# EAGLE board humanoid-11 (EAGLE 7.2.0)
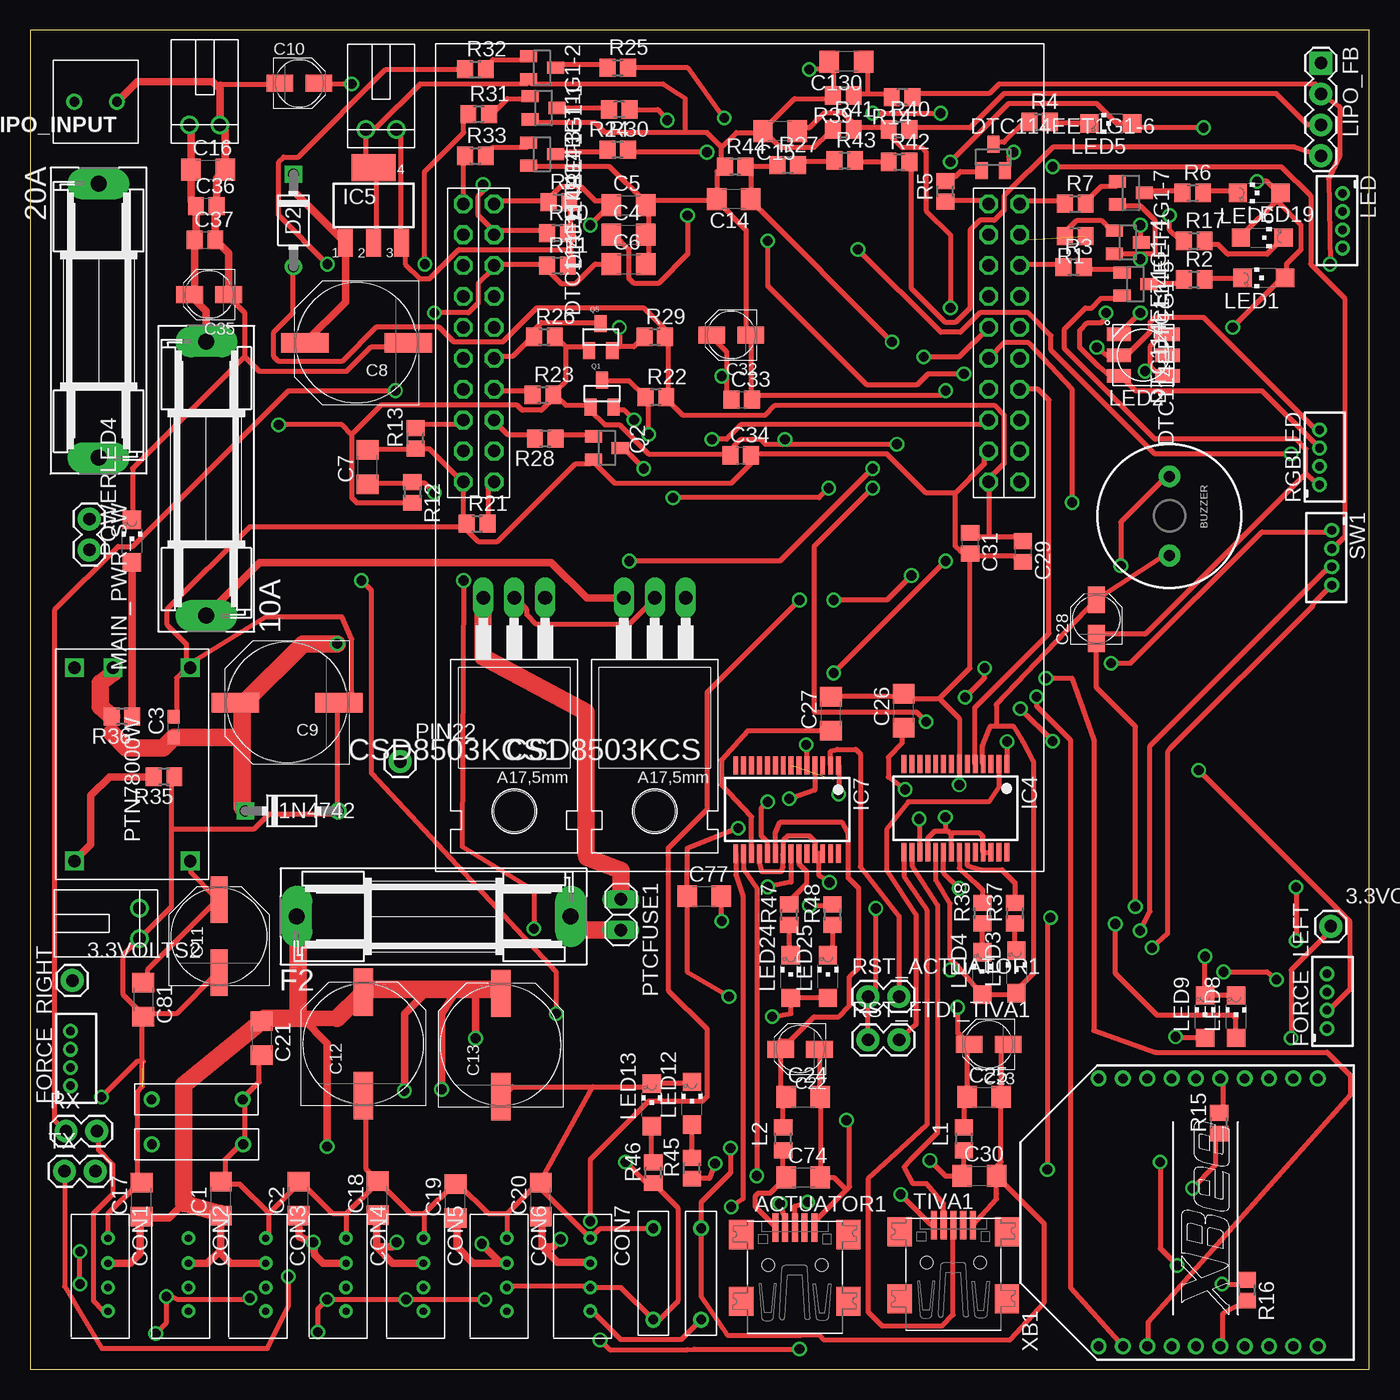
[diagram p10: board, top side]
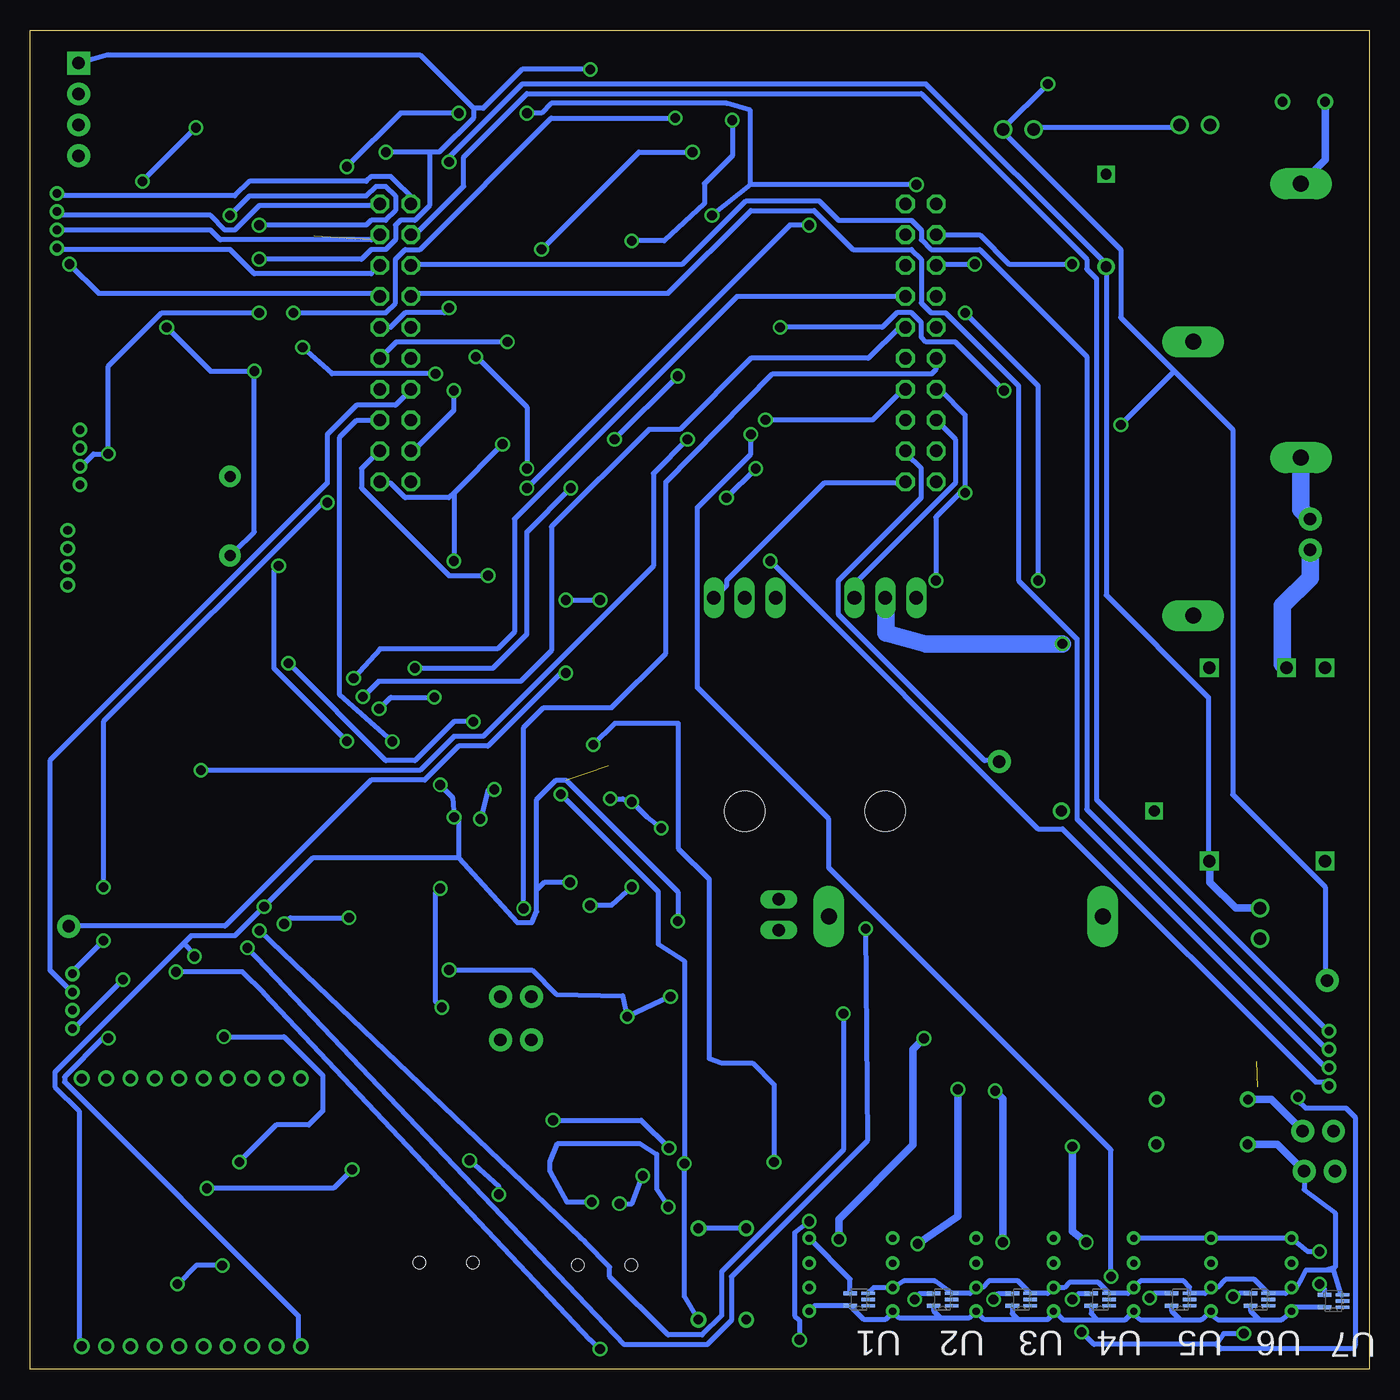
[diagram p11: board, bottom side, seen from below]

Size 110 x 110 mm. Coordinates in mm from the lower left corner, seen from the top.
Outline: 0,0 110,0 110,110 0,110 0,0
Copper layers (1*16): Top 0.035mm / dielectric 1.5mm / Bottom 0.035mm
Design rules "default *": minimum track width 0.4mm, minimum drill 0.8mm, track to track 0.4mm, track to pad 8mil, pad to pad 8mil, via to via 8mil, smd to smd 8mil, copper to edge 40mil, drill to drill 0.8mm, minimum pad ring 10mil, minimum via ring 8mil, stop-mask expansion 4mil, vias tented up to drill 0mil, thermal gap 10mil
Net classes: 0 default: width 0.35 mm

## Footprints (pad centres in the part's own frame; a part is rotated, then mirrored left to right if it is on the bottom)
DO41-3 = drill 0.9: A 3.81,0 | drill 0.9 square: C -3.81,0
2PINRIGHT = drill 1.02: P$1 0,0; P$2 2.5,0
1X01 = drill 1.016 pad 1.88: 1 0,0
SH22,5 = drill 1.321 pad 2.54 long: 1 -11.252,0; 2 11.252,0
USB-MINIB = smd 0.5 x 2.308: D+ 0,4.064; D- -0.8,4.064; GND 1.6,4.064; ID 0.8,4.064; VBUS -1.6,4.064 | smd 2 x 2.4: GND1 -4.4,-2; GND2 -4.4,3.5; GND3 4.4,3.5; GND4 4.4,-2 | hole 1: -2.2,1; 2.2,1
BUZZER-12MM = drill 0.9 pad 1.778: + 3.25,0; - -3.25,0
C1206 = smd 1.6 x 1.8: 1 -1.4,0; 2 1.4,0
C1608 = smd 1.1 x 1: 1 -0.85,0; 2 0.85,0
PANASONIC_G = smd 3.9 x 1.6: + 4.25,0; - -4.25,0
PANASONIC_B = smd 2.2 x 1.4: + 1.6,0; - -1.6,0
PANASONIC_E = smd 3.8 x 1.4: + 3,0; - -3,0
C0805 = smd 1.3 x 1.5: 1 -0.85,0; 2 0.85,0
B4B-ZR = drill 0.6: 1 7.95,-1.75; 2 6,-1.75; 3 4,-1.75; 4 1.95,-1.75
TO220 = drill 1.118 long: 1 -2.54,-6.35; 2 0,-6.35; 3 2.54,-6.35 | hole 3.302: 0,11.176
SOT23 = smd 1 x 1.4: 1 -0.95,-1.1; 2 0.95,-1.1; 3 0,1.1
B4B-ZR' = drill 0.7 pad 1.1: 1 -2.25,0; 2 -0.75,0; 3 0.75,0; 4 2.25,0
SSOP28 = smd 0.4 x 1.5: 1 -4.225,-3.625; 2 -3.575,-3.625; 3 -2.925,-3.625; 4 -2.275,-3.625; 5 -1.625,-3.625; 6 -0.975,-3.625; 7 -0.325,-3.625; 8 0.325,-3.625; 9 0.975,-3.625; 10 1.625,-3.625; 11 2.275,-3.625; 12 2.925,-3.625; 13 3.575,-3.625; 14 4.225,-3.625; 15 4.225,3.625; 16 3.575,3.625; 17 2.925,3.625; 18 2.275,3.625; 19 1.625,3.625; 20 0.975,3.625; 21 0.325,3.625; 22 -0.325,3.625; 23 -0.975,3.625; 24 -1.625,3.625; 25 -2.275,3.625; 26 -2.925,3.625; 27 -3.575,3.625; 28 -4.225,3.625
SOT223 = smd 1.219 x 2.235: 1 -2.311,-3.099; 2 0,-3.099; 3 2.311,-3.099 | smd 3.6 x 2.2: 4 0,3.099
L0805 = smd 1.3 x 1.5: 1 -0.95,0; 2 0.95,0
CHIPLED_1206 = smd 1.5 x 1.5: A 0,-1.75; C 0,1.75
RGBLED5050 = smd 2 x 1.1: 1 -2,1.7; 2 -2,0; 3 -2,-1.7; 4 2,-1.7; 5 2,0; 6 2,1.7
1X04 = drill 1.016 pad 1.88 square: 1 0,0 | drill 1.016 pad 1.88: 2 2.54,0; 3 5.08,0; 4 7.62,0
ED350V-02P = drill 0.8: P$1 0,0; P$2 3.5,0
1X02 = drill 1.016 pad 1.88: 1 0,0; 2 2.54,0
1X02' = drill 1.016 long: 1 -1.27,0; 2 1.27,0
R0805 = smd 1.3 x 1.5: 1 -0.85,0; 2 0.85,0
SOT50P160X60-5N = smd 1.118 x 0.254: 1 -0.737,0.508; 2 -0.737,0; 3 -0.737,-0.508 | smd 1.118 x 0.305: 4 0.737,-0.508; 5 0.737,0.508
TIVA = drill 1.02 octagon: P$1 0,0; P$2 2.54,0; P$3 5.08,0; P$4 7.62,0; P$5 10.16,0; P$6 12.7,0; P$7 15.24,0; P$8 17.78,0; P$9 20.32,0; P$10 22.86,0; P$11 0,2.54; P$12 2.54,2.54; P$13 5.08,2.54; P$14 7.62,2.54; P$15 10.16,2.54; P$16 12.7,2.54; P$17 15.24,2.54; P$18 17.78,2.54; P$19 20.32,2.54; P$20 22.86,2.54; P$21 0,43.18; P$22 2.54,43.18; P$23 5.08,43.18; P$24 7.62,43.18; P$25 10.16,43.18; P$26 12.7,43.18; P$27 15.24,43.18; P$28 17.78,43.18; P$29 20.32,43.18; P$30 22.86,43.18; P$31 0,45.72; P$32 2.54,45.72; P$33 5.08,45.72; P$34 7.62,45.72; P$35 10.16,45.72; P$36 12.7,45.72; P$37 15.24,45.72; P$38 17.78,45.72; P$39 20.32,45.72; P$40 22.86,45.72
PTN78000W = drill 1.02 square: P1 1.52,11.045; P2 1.52,4.705; P3 1.52,1.525; P4 17.4,1.52; P5 17.4,11.045
V18ZA2P = drill 0.8: P$1 0,0; P$2 7.5,0
XBEE = drill 0.8 pad 1.27: 1 -11,9; 2 -11,7; 3 -11,5; 4 -11,3; 5 -11,1; 6 -11,-1; 7 -11,-3; 8 -11,-5; 9 -11,-7; 10 -11,-9; 11 11,-9; 12 11,-7; 13 11,-5; 14 11,-3; 15 11,-1; 16 11,1; 17 11,3; 18 11,5; 19 11,7; 20 11,9

## Placement (x,y rotation side)
1N4742  [DO41-3]  21.47,45.87 0 top
3.3V1  2PINRIGHT  [2PINRIGHT]  27.56,101.85 0 top
3.3VOLTS1  M01PTH  [1X01]  106.86,36.39 0 top
3.3VOLTS2  M01PTH  [1X01]  3.45,31.93 0 top
5V1  2PINRIGHT  [2PINRIGHT]  8.97,35.38 90 top
10A  FUSESH22,5  [SH22,5]  14.45,73.16 90 top
20A  FUSESH22,5  [SH22,5]  5.6,86.14 270 top
ACTUATOR1  [USB-MINIB]  62.81,7.56 0 top
BUZZER  BUZZERPTH  [BUZZER-12MM]  93.6,70.1 270 top
C1  100nF  [C1206]  15.65,14 90 top
C2  100nF  [C1206]  22.03,14 90 top
C3  2.2uF  [C1608]  11.76,52.75 90 top
C4  0.1uF  [C1206]  49.15,93.22 0 top
C5  0.1uF  [C1206]  49.15,95.63 0 top
C6  0.1uF  [C1206]  49.15,90.81 0 top
C7  0.1uF  [C1206]  27.71,74.12 90 top
C8  220uF 25V  [PANASONIC_G]  26.8,84.33 180 top
C9  470uF 25V  [PANASONIC_G]  21.09,54.77 180 top
C10  22uF 10V  [PANASONIC_B]  22.1,105.66 0 top
C11  100uF 10V  [PANASONIC_E]  15.51,35.57 90 top
C12  220uF 25V  [PANASONIC_G]  27.36,26.73 90 top
C13  220uF 25V  [PANASONIC_G]  38.65,26.62 90 top
C14  100nF  [C1206]  57.78,96.14 180 top
C15  100nF  [C1206]  61.59,101.73 180 top
C16  100nF  [C1206]  14.61,98.55 0 top
C17  100nF  [C1206]  9.13,13.93 90 top
C18  100nF  [C1206]  28.54,14.06 90 top
C19  100nF  [C1206]  34.92,13.8 90 top
C20  100nF  [C1206]  41.94,13.93 90 top
C21  100nF  [C1206]  18.99,27.2 270 top
C22  4.7uF 10V  [PANASONIC_B]  63.25,26.29 180 top
C23  4.7uF 10V  [PANASONIC_B]  78.74,26.67 180 top
C24  100nF  [C1206]  63.5,22.35 0 top
C25  100nF  [C1206]  78.36,22.35 0 top
C26  100nF  [C1206]  71.75,54.1 90 top
C27  100nF  [C1206]  65.79,53.85 90 top
C28  10uF 16V  [PANASONIC_B]  87.6,61.62 90 top
C29  0.1uF  [C0805]  81.56,67.18 270 top
C30  10nF  [C1206]  77.98,15.88 0 top
C31  0.1uF  [C0805]  77.22,67.87 270 top
C32  10uF 16V  [PANASONIC_B]  57.58,84.96 180 top
C33  0.1uF  [C0805]  58.45,79.65 0 top
C34  0.1uF  [C0805]  58.37,75.08 0 top
C35  10uF 16V  [PANASONIC_B]  14.68,88.29 180 top
C36  0.1uF  [C0805]  14.45,95.55 0 top
C37  0.1uF  [C0805]  14.35,92.79 0 top
C74  10nF  [C1206]  63.5,15.75 0 top
C77  100nF  [C1206]  55.37,38.86 0 top
C81  100nF  [C1206]  9.27,30.35 270 top
C130  100nF  [C1206]  67.06,107.44 180 top
CON1  B4B-ZR  [B4B-ZR]  8.13,12.7 270 top
CON2  B4B-ZR  [B4B-ZR]  14.73,12.7 270 top
CON3  B4B-ZR  [B4B-ZR]  21.08,12.7 270 top
CON4  B4B-ZR  [B4B-ZR]  27.69,12.7 270 top
CON5  B4B-ZR  [B4B-ZR]  34.04,12.7 270 top
CON6  B4B-ZR  [B4B-ZR]  40.89,12.7 270 top
CON7  B4B-ZR  [B4B-ZR]  47.75,12.7 270 top
CSD8503KCS  BUZ20  [TO220]  51.31,57.02 180 top
CSD8503KCS1  BUZ20  [TO220]  39.75,57.02 180 top
D2  1N5817  [DO41-3]  21.61,94.39 270 top
DTC114EET1G1-1  [SOT23]  42.16,103.63 270 top
DTC114EET1G1-2  [SOT23]  42.04,106.93 270 top
DTC114EET1G1-3  [SOT23]  42.04,99.82 270 top
DTC114EET1G1-4  [SOT23]  90.17,92.58 270 top
DTC114EET1G1-5  [SOT23]  90.81,89.15 270 top
DTC114EET1G1-6  [SOT23]  79.12,99.57 0 top
DTC114EET1G1-7  [SOT23]  90.42,96.65 270 top
F2  FUSESH22,5  [SH22,5]  33.13,37.2 0 top
FITPC  2PINRIGHT  [2PINRIGHT]  13.08,102.23 0 top
FORCE_LEFT  B4B-ZR  [B4B-ZR']  106.55,30.23 90 top
FORCE_RIGHT  B4B-ZR  [B4B-ZR']  3.3,25.53 90 top
IC4  FT232RL  [SSOP28]  76.01,46.09 180 top
IC5  LM2936MP-3.3  [SOT223]  28.19,95.63 0 top
IC7  FT232RL  [SSOP28]  62.18,45.98 180 top
L1  33 mH 1.5A  [L0805]  76.71,18.92 90 top
L2  33 mH 1.5A  [L0805]  61.85,18.92 90 top
LED  B4B-ZR  [B4B-ZR']  107.82,94.36 270 top
LED1  [CHIPLED_1206]  101.35,89.66 90 top
LED2  RGBLED5050  [RGBLED5050]  91.44,83.31 180 top
LED3  [CHIPLED_1206]  81.03,32.64 0 top
LED4  [CHIPLED_1206]  78.23,32.51 0 top
LED5  [CHIPLED_1206]  88.77,102.36 90 top
LED6  [CHIPLED_1206]  100.97,96.65 90 top
LED8  [CHIPLED_1206]  99.06,28.96 0 top
LED9  [CHIPLED_1206]  96.52,28.96 0 top
LED12  [CHIPLED_1206]  54.36,21.84 0 top
LED13  [CHIPLED_1206]  51.05,21.72 0 top
LED19  [CHIPLED_1206]  101.22,92.96 270 top
LED24  [CHIPLED_1206]  62.48,32.26 0 top
LED25  [CHIPLED_1206]  65.53,32.26 0 top
LIPO_FB  [1X04]  106.05,107.31 270 top
LIPO_INPUT  ST02-3.5MM  [ED350V-02P]  7.11,104.14 180 top
MAIN_PWR_SW  [1X02]  4.84,69.85 270 top
PIN22  M01PTH  [1X01]  30.39,49.91 0 top
POWERLED4  [CHIPLED_1206]  8.34,68.04 0 top
PTCFUSE1  [1X02']  48.51,37.34 270 top
Q1  MOSFET-NCHANNELBSS138  [SOT23]  46.97,80.15 0 top
Q2  [SOT23]  47.37,75.69 270 top
Q5  MOSFET-NCHANNELBSS138  [SOT23]  46.86,84.8 0 top
R1  10K  [R0805]  85.85,93.09 180 top
R2  330E  [R0805]  95.63,89.53 0 top
R3  10K  [R0805]  85.72,90.55 0 top
R4  330E  [R0805]  82.93,102.49 0 top
R5  10K  [R0805]  75.18,96.77 90 top
R6  330E  [R0805]  95.5,96.65 0 top
R7  10K  [R0805]  85.85,95.76 0 top
R9  10K  [R0805]  43.43,95.89 0 top
R10  10K  [R0805]  43.31,93.34 0 top
R11  10K  [R0805]  43.31,90.68 0 top
R12  10K  [R0805]  31.39,72.03 270 top
R13  1M  [R0805]  31.65,76.48 90 top
R14  10k  [R0805]  71.63,104.52 180 top
R15  330R  [R0805]  97.66,20.19 90 top
R16  330R  [R0805]  99.95,6.48 270 top
R17  330E  [R0805]  95.63,92.71 0 top
R21  1M  [R0805]  36.7,69.47 0 top
R22  10K  [R0805]  51.4,79.88 0 top
R23  10K  [R0805]  42.12,80.05 0 top
R24  330E  [R0805]  48.39,103.5 180 top
R25  330E  [R0805]  48.26,106.93 0 top
R26  10K  [R0805]  42.24,84.83 0 top
R27  10k  [R0805]  62.23,98.93 0 top
R28  10k  [R0805]  42.29,76.45 180 top
R29  10K  [R0805]  51.31,84.81 0 top
R30  330E  [R0805]  48.26,100.2 0 top
R31  10K  [R0805]  36.83,103.12 0 top
R32  10K  [R0805]  36.58,106.81 0 top
R33  10K  [R0805]  36.58,99.69 0 top
R35  21K  [R0805]  10.99,48.67 180 top
R36  1k  [R0805]  7.53,53.62 180 top
R37  270E  [R0805]  80.9,37.47 90 top
R38  270E  [R0805]  78.23,37.47 90 top
R39  10k  [R0805]  66.8,104.65 180 top
R40  30k  [R0805]  71.37,101.85 0 top
R41  10k  [R0805]  66.8,101.85 0 top
R42  30k  [R0805]  71.37,99.19 0 top
R43  30k  [R0805]  66.93,99.31 0 top
R44  10k  [R0805]  57.91,98.81 0 top
R45  330E  [R0805]  54.36,16.51 90 top
R46  330E  [R0805]  51.18,16.13 90 top
R47  270E  [R0805]  62.36,37.34 90 top
R48  270E  [R0805]  65.91,37.34 90 top
RGBLED  B4B-ZR  [B4B-ZR']  105.92,74.93 90 top
RST_ACTUATOR1  [1X02]  68.83,30.61 0 top
RST_FTDI_TIVA1  [1X02]  68.83,27.05 0 top
RX  [1X02]  2.92,19.56 0 top
SW1  B4B-ZR  [B4B-ZR']  106.93,66.67 270 top
TIVA1  [USB-MINIB]  75.84,7.77 0 top
TX  [1X02]  2.79,16.26 0 top
U1  TPD2E2U06  [SOT50P160X60-5N]  41.91,5.71 180 bottom
U2  TPD2E2U06  [SOT50P160X60-5N]  35.05,5.71 180 bottom
U3  TPD2E2U06  [SOT50P160X60-5N]  28.57,5.71 180 bottom
U4  TPD2E2U06  [SOT50P160X60-5N]  22.1,5.71 180 bottom
U5  TPD2E2U06  [SOT50P160X60-5N]  15.49,5.71 180 bottom
U6  TPD2E2U06  [SOT50P160X60-5N]  9.02,5.71 180 bottom
U7  TPD2E2U06  [SOT50P160X60-5N]  2.92,5.59 180 bottom
U$1  TIVA  [TIVA]  81.28,72.9 90 top
U$4  PTN78000WTHROUGHHOLE  [PTN78000W]  2.09,59.15 270 top
V8ZA2P-1  V18ZA2P  [V18ZA2P]  17.45,22.15 180 top
V8ZA2P-2  V18ZA2P  [V18ZA2P]  17.48,18.47 180 top
V8ZA2P-3  V18ZA2P  [V18ZA2P]  55.12,4.06 90 top
V8ZA2P-4  V18ZA2P  [V18ZA2P]  51.18,4.06 90 top
XB1  XBEE  [XBEE]  96.78,12.88 90 top

## Tracks (layer width: path | path; a pad name or v marks a point on that pad's centre or on a via)
3.3V  (via drill 0.8)
  Top 0.4: 44.4,92 44.4,93.2 R10.2 44.4,93.6 44.4,95.6 R9.2 | 44.4,92 44.4,90.8 R11.2 | v26.4,105.6 24,105.6 C10.+ | 3.3V1.P$2 30.4,101.6 30.4,92.8 IC5.3 30.8,92.4 30.8,90.8 32,89.6 32.8,89.6 35.2,92 44.4,92 | v103.6,27.2 103.6,32.8 106.8,36 3.3VOLTS1.1 | 57.2,81.6 57.2,83.6 56,84.8 C32.+ | 57.2,81.6 57.2,80 C33.1 | 44,84 45.6,84 Q5.1 | 44,84 43.2,84.8 R26.2 | 43.2,80 44,79.2 46,79.2 Q1.1 46,78.8 47.2,77.6 48.4,77.6 50.8,75.2 57.2,75.2 | 26.4,76.8 26.4,71.6 26.8,71.2 31.2,71.2 R12.2 | 26.4,76.8 28.8,79.2 40,79.2 40.4,78.8 42,78.8 43.2,80 | 43.2,80 R23.2 43.2,80.4 44,81.2 44,84 | 62,76 60.4,76 60,76.4 58.4,76.4 57.2,75.2 | 62,76 v71.2,76 | 57.2,75.2 C34.1 | v56.8,81.6 57.2,81.6 | 62,76 v62,76.4 | v75.2,66.4 v66,57.2 | v20.4,77.6 25.6,77.6 26.4,76.8
  Bottom 0.4: v26.4,105.6 30,102 3.3V1.P$2 30,101.6 20.4,92 20.4,86.4 16,82 | 16,82 11.2,77.2 11.2,47.2 3.6,39.6 3.6,32 3.3VOLTS2.1 | v103.6,27.2 104,27.2 107.2,24 107.2,23.6 88,4.4 88,2 XB1.1 | v71.2,76 75.2,72 | 75.2,72 75.6,71.6 79.2,71.6 80.4,72.8 81.2,72.8 U$1.P$1 | v62,76.4 v56.8,81.6 | v66,57.2 66.4,57.2 72.4,51.2 74.8,51.2 77.6,48.4 82,48.4 94,36.4 106.8,36.4 3.3VOLTS1.1 | 75.2,72 v75.2,66.4 | v20.4,77.6 16,82
5V  (via drill 0.8)
  Top 0.4: 92,82.4 92.4,82 93.2,82 LED2.1 | 92,82.4 92,84 93.2,85.2 LED2.3 | v91.6,82 92,82.4 | 102.4,96 102.8,96.4 LED6.A | 102.4,96 99.6,93.2 LED19.A | v96.4,102 90.8,102 LED5.A 90.4,102.4 89.2,102.4 87.6,104 80.4,104 v75.6,99.2 | v100.8,97.6 101.6,97.6 102.4,96.8 LED6.A | 102.4,96 104.4,94 104.4,92 103.2,90.8 103.2,90 LED1.A 102.8,89.6 v98.8,85.6 | 102.4,96 LED6.A | v75.6,32.8 76,33.2 76.07,33.26 | C81.1 9.6,32 9.6,32.8 15.2,38.4 C11.+ 15.2,38.8 13.2,40.8 13.2,41.6 U$4.P5 | 78.8,68.4 77.6,68.4 C31.1 | 78.8,68.4 81.2,68.4 C29.1 | 78.8,68.4 78.8,72.8 U$1.P$11 78.8,73.2 80,74.4 80,78.4 79.2,79.2 61.2,79.2 60.4,78.4 53.6,78.4 52.4,79.6 R22.2 52.4,80 52.4,84.8 R29.2 52.4,85.2 50.4,87.2 41.6,87.2 38.8,84.4 34.8,84.4 33.6,85.6 28.4,85.6 25.6,82.8 20.4,82.8 20,83.2 20,85.2 21.6,86.8 21.6,90.4 D2.A
  Top 0.406: IC7.4 64.46,47.57 v62.36,46.86 | v58.17,44.45 57.4,44.2 53.98,42.8 C77.1 53.97,32.64 v57.4,30.61 | v60.96,28.96 62.51,29.21 LED24.A LED25.A | IC4.19 74.39,40.17 75.56,38.23 75.56,33.68 76.07,33.26 LED4.A 80.9,30.76 LED3.A 81.03,31.11 82.42,32.51 82.42,49.91 81.53,51.56 80.77,52.83 79.25,52.83 | IC4.4 78.23,49.77 78.23,51.18 78.87,52.83 79.25,52.83 | BUZZER.+ 93.14,66.85 C28.+ 79.38,54.61 79.38,52.96 79.25,52.83 | IC7.19 60.56,43.33 60.07,43.81 60.07,46.1 v60.58,46.61
  Bottom 0.4: BUZZER.+ 93.2,67.2 91.6,68.8 v91.6,82 95.2,82 v98.8,85.6 | v100.8,97.6 v96.4,102 | v75.6,32.8 68.8,32.8 66.8,30.8 61.33,30.67 v60.96,28.96 | U$4.P5 13.2,42 13.2,55.2 21.6,63.6 21.6,90.4 D2.A 21.6,90.8 36.4,105.6 69.6,105.6 75.6,99.6 v75.6,99.2
  Bottom 0.406: v62.36,46.86 61.34,46.86 v60.58,46.61 59.31,45.34 v58.17,44.45 | v57.4,30.61 v60.96,28.96
  Bottom 0.61: 5V1.P$2 10.96,37.88 13.08,40.01 13.08,41.7 U$4.P5
GND  (via drill 0.8)  (2 unrouted)
  Top 0.4: IC5.2 28.4,92.8 28.4,98.4 IC5.4 28,98.8 27.6,99.2 27.6,101.6 3.3V1.P$1 27.6,102 28.4,102 32,105.6 40.8,105.6 DTC114EET1G1-2.2 41.2,105.6 51.99,105.6 53.83,104.4 53.83,101.6 | 17.6,83.2 8.4,74 8.4,70 POWERLED4.C | 17.6,83.2 17.6,86.8 16.4,88 C35.- | C10.- 20.4,105.6 15.6,105.6 15.39,105.39 | 17.6,83.2 18.8,82 26,82 28,84 30.8,84 C8.- | 91.2,91.6 92.4,91.6 92.4,94.4 91.2,95.6 89.6,95.6 DTC114EET1G1-7.2 | 91.2,91.6 89.2,91.6 DTC114EET1G1-4.2 | v80.8,100 80.4,99.6 80.4,98.8 DTC114EET1G1-6.2 | v91.2,91.2 91.2,91.6 | C6.2 50.8,91.2 50.8,93.2 C4.2 50.8,93.6 50.8,95.6 C5.2 | DTC114EET1G1-3.2 41.2,98.8 47.6,98.8 50.4,96 C5.2 | 66,106.8 66,107.2 C130.2 66,106.8 | 66,106.8 66,104.8 R39.2 65.6,104.4 62.8,104.4 60.4,102 C15.2 | R41.1 65.6,101.6 64.4,100.4 61.6,100.4 60.4,101.6 C15.2 | 53.83,101.6 55.6,101.6 56.8,100.4 | 53.83,101.6 47.2,101.6 46.4,102.4 41.2,102.4 DTC114EET1G1-1.2 | 56.8,100.4 56.8,99.2 R44.1 56.8,98.8 56.4,98.4 56.4,96.4 C14.2 | C14.2 56.4,96 58.8,93.6 58.8,85.2 C32.- 59.2,84.8 59.2,80 C33.2 59.6,80 74.8,80 v75.2,80.4 | 56.8,100.4 58,101.6 60,101.6 C15.2 | C5.2 50.8,96 56,96 C14.2 | 66,106.8 v64,106.8 | 39.6,23.2 38.8,22.4 C13.- | LED13.C 50.8,23.2 46.19,23.2 42,15.6 C20.2 41.6,15.2 | 39.2,12.8 41.6,15.2 | 39.2,12.8 39.2,10.8 CON6.4 | 32.4,12.8 34.8,15.2 C19.2 35.2,15.2 37.6,12.8 39.2,12.8 | 32.4,12.8 32.4,10.8 CON5.4 | 26,12.8 28.4,15.2 C18.2 | 26,12.8 26,10.8 CON4.4 | C12.- 27.6,22.4 27.6,16.4 28.4,15.6 C18.2 | 32.4,12.8 31.2,12.8 28.8,15.2 C18.2 | C3.2 12,54 12,56.8 12.8,57.6 U$4.P1 | U$4.P1 13.2,58 19.35,61.81 22.27,61.82 25.6,61.82 26.4,60 26.4,55.6 25.6,54.8 C9.- 25.2,54.4 25.2,46 1N4742.A 25.2,45.6 19.6,45.6 18.4,44.4 11.6,44.4
  Top 0.4: C81.2 9.6,29.2 12,29.2 15.2,32.4 C11.- | 11.6,44.4 11.6,38 9.2,35.6 5V1.P$1 8.8,35.2 7.6,34 7.6,30.8 9.2,29.2 C81.2 | 11.6,44.4 11.6,48.4 R35.1 | C21.2 18.8,25.6 18.8,23.6 17.6,22.4 V8ZA2P-1.P$1 17.6,22 17.6,18.8 V8ZA2P-2.P$1 17.2,18.4 16,17.2 16,15.6 C1.2 16,15.2 17.2,15.2 19.6,12.8 | CON1.4 6.4,10.8 6.4,12.8 8.8,15.2 C17.2 8.8,15.6 8.8,22.8 9.2,23.2 9.2,28.8 C81.2 | 19.6,12.8 22,15.2 C2.2 22.4,15.2 24.8,12.8 26,12.8 | 19.6,12.8 19.6,10.8 CON3.4 | 41.6,15.2 46,10.8 CON7.4 | 87.2,87.2 88,88 89.6,88 DTC114EET1G1-5.2 | 87.2,81.6 92.4,76.4 104,76.4 104.8,75.6 104.8,73.6 | 104.8,73.6 105.6,72.8 RGBLED.1 | 104.8,73.6 91.6,60.4 88,60.4 C28.- 87.6,60 87.6,56 90.8,52.8 v90.8,38 | C7.2 28,75.6 31.6,75.6 R13.1 32,75.6 32.8,75.6 35.2,73.2 U$1.P$31 35.6,72.8 35.6,69.6 R21.1 35.6,69.2 | 35.6,69.2 36.8,68 38.4,68 44.8,74.4 46,74.4 Q2.2 46.4,74.4 48,72.8 57.6,72.8 59.2,74.4 59.2,74.8 C34.2 59.6,75.2 70.4,75.2 73.6,72 76,72 | C31.2 77.6,66.8 80.8,66.8 81.2,66.4 C29.2 | 76,72 78.4,74.4 78.4,75.2 U$1.P$12 | 76,72 76,67.6 76.4,67.2 77.2,67.2 C31.2 | v56.8,36.8 56.8,38.8 C77.2 | v65.65,39.98 64.89,40.51 64.8,40.55 64.8,42.36 64.8,42.4 | 74.7,55.1 77.2,57.6 77.2,66.8 C31.2 | 35.6,69.2 18,69.2 11.2,62.4 11.2,61.2 12.8,59.6 12.8,58 U$4.P1
  Top 0.406: IC7.26 64.8,42.36 IC7.25 64.52,42.42 64.52,43.31 64.01,43.81 62.23,43.81 61.85,43.43 61.85,42.6 IC7.21 61.85,42.37 61.85,41.27 61.72,40.89 60.07,40.89 59.91,41.56 IC7.18 | IC4.18 73.74,43.64 74.3,44.2 75.18,44.2 | IC4.21 75.69,43.95 | 75.69,43.95 75.44,44.2 75.18,44.2 | IC4.26 IC4.25 78.29,43.76 77.98,44.07 75.81,44.07 75.69,43.95 | C22.- 64.85,22.41 C24.2 C74.2 66.04,15.75 67.06,14.73 | LED12.C 54.23,23.47 LED13.C | CON7.4 46.82,11.56 V8ZA2P-4.P$2 | 77.47,11.68 TIVA1.GND 79.39,13.96 79.38,14.4 C30.2 | C23.- 79.76,26.09 C25.2 79.76,16.99 79.38,16.61 C30.2 | C26.2 71.5,55.25 | 71.5,55.25 C27.2 | 71.5,55.25 71.63,55.12 74.68,55.12 74.7,55.1 76.34,53.46 IC4.7 76.33,49.71 v76.33,48.01 | 75.18,45.59 v75.18,45.34 75.18,44.2 | v4.06,6.99 v4.06,9.65 | v18.03,5.84 17.65,5.71 12.06,5.71 11.56,5.97 v11.18,5.97 11.18,3.81 v10.29,2.92 | v37.34,5.71 v30.86,5.71 v24.38,5.71 23.62,4.95 v23.62,3.05 | 9.27,25.27 8.76,25.27 v5.84,22.35 | 87.2,81.6 84.96,83.84 84.96,85.47 86.69,87.2 87.2,87.2 | LED8.C LED9.C v96.52,33.91 | C30.2 83.31,11.94 83.31,5.46 80.52,2.41 65.17,2.41 64.79,2.82 63.37,2.79 57.28,2.79 55.12,5.97 V8ZA2P-3.P$2 55.12,13.72 57.53,16.13 v57.53,18.16 | ACTUATOR1.GND 64.41,12.09 67.06,14.73 | 67.06,14.73 67.31,14.99 67.31,20.19 v67.06,20.45 | 39.6,23.2 46.19,23.2
  Top 0.61: LIPO_INPUT.P$1 8.76,105.79 14.99,105.79 15.39,105.39 15.58,105.2 FITPC.P$2 16,101.81 C16.2 15.3,97.85 C36.2 15.2,95.45 C37.2 16.28,91.71 C35.-
  Bottom 0.4: 3.3V1.P$1 27.2,102 15.6,102 FITPC.P$2 | 77.2,100 76.4,100 73.6,102.8 73.6,103.6 | 77.2,100 v80.8,100 | 73.6,103.6 78,108 103.57,108 LIPO_FB.1 | v91.2,91.2 82.8,91.2 82,92 80.8,92 80,92.8 80,94 79.6,94.4 78.4,94.4 77.2,95.6 77.2,100 | 73.6,103.6 72.8,103.6 69.6,106.8 v64,106.8 | CON3.4 19.2,10.8 13.2,10.8 CON2.4 12.8,10.8 6.4,10.8 CON1.4 | v56.8,36.8 56.8,39.2 66,48.4 66.8,48.4 68.4,46.8 68.4,39.37 68.4,37.6 68.8,36.69 70,36.69 74.8,42 | 74.8,42 74.8,45.2 v75.18,45.34 | 74.8,42 86.8,42 v90.8,38 93.2,35.6 96.8,35.6 97.38,35.02 108,24.4 108,23.2 106,21.2 106,2 XB1.10 | v75.2,80.4 75.2,78.8 78.4,75.6 U$1.P$12
  Bottom 0.406: V8ZA2P-4.P$2 V8ZA2P-3.P$2 | v76.33,48.01 75.31,46.99 v75.18,45.34 | U7.4 3.66,6.58 v4.06,6.99 | v4.06,9.65 5.03,9.65 CON1.4 | U6.4 10.67,6.22 v11.18,5.97 | v24.38,5.71 23.85,6.22 U4.4 | v30.86,5.71 30.45,6.22 U3.4 | v37.34,5.71 36.93,6.22 U2.4 | U1.4 42.65,7.39 CON7.4 | v10.29,2.92 11.94,2.92 12.57,2.03 | v23.62,3.05 22.61,2.03 12.57,2.03 | U5.4 17.65,6.22 v18.03,5.84 | v5.84,22.35 5.84,22.1 5.21,21.46 1.91,21.46 1.14,20.7 1.14,2.03 1.27,1.65 12.19,1.65 12.57,2.03 | v96.52,33.91 96.52,34.04 97.38,35.02 | v67.06,20.45 59.82,20.45 v57.53,18.16 | v65.65,39.98 67.79,39.98 68.4,39.37
HX_RX  (via drill 0.8)
  Top 0.4: RX.2 5.6,19.2 5.6,18 6.8,16.8 6.8,14.4 5.2,12.8 5.2,5.6 6,4.8 CON1.1
  Top 0.406: IC7.1 66.42,49.59 v66.42,47.24 | v56.26,16.89 55.79,15.66 R45.1 | V8ZA2P-3.P$1 53.47,2.41 48.51,2.41 46.18,4.75 CON7.1
  Bottom 0.406: U7.5 6.05,5.08 CON1.1 7.19,4.06 9.02,4.06 | CON7.1 45.55,5.21 U1.5 41.5,4.06 39.75,4.06 39.14,4.67 CON6.1 38.59,4.19 35.18,4.19 | v66.42,47.24 58.42,39.24 58.42,34.92 56.26,33.53 v56.26,16.89 56.26,5.97 V8ZA2P-3.P$1 | 35.18,4.19 32.89,4.19 32.33,4.75 CON5.1 31.6,4.06 28.83,4.06 | 28.83,4.06 26.42,4.06 25.94,4.54 CON4.1 25.83,4.75 25.15,4.06 22.35,4.06 | U3.5 29.31,4.55 28.83,4.06 | U2.5 35.79,4.8 35.18,4.19 | 22.35,4.06 20.02,4.06 CON3.1 19.33,4.47 18.8,4.06 15.49,4.06 | U4.5 22.84,4.55 22.35,4.06 | 15.49,4.06 13.79,4.06 CON2.1 12.93,4.7 12.93,4.42 12.45,4.06 9.02,4.06 | U5.5 16.23,4.8 15.49,4.06 | U6.5 9.75,4.8 9.02,4.06
  Bottom 0.61: RX.2 8.05,22.15 V8ZA2P-1.P$2
HX_TX  (via drill 0.8)
  Top 0.4: CON6.2 39.2,6.8 46,6.8 CON7.2
  Top 0.406: CON7.2 48.55,6.7 V8ZA2P-4.P$1 51.69,4.06 53.21,5.59 53.21,13.25 R46.1 50.63,15.28 v48.9,17.02 | IC7.5 63.81,51.25 v63.75,51.31
  Bottom 0.406: U7.3 2.29,6.1 2.92,8.13 3.56,8.13 | 3.56,8.13 5.2,8.13 5.59,7.37 6,6.7 CON1.2 6.86,6.22 U6.3 9.42,7.37 11.81,7.37 12.48,6.7 CON2.2 13.46,6.22 U5.3 14.76,6.76 15.24,7.24 18.79,7.24 CON3.2 19.81,6.22 U4.3 22.25,7.11 24.64,7.11 25.05,6.7 CON4.2 26.41,6.22 U3.3 28.85,7.24 31.24,7.24 31.78,6.7 CON5.2 32.76,6.22 U2.3 34.31,6.25 35.69,7.24 38.22,7.24 CON6.2 40.7,6.7 U1.3 | v63.75,51.31 61.98,53.09 56.77,53.09 56.77,42.8 54.23,40.26 54.23,25.53 53.21,25.15 50.67,25.15 48.9,23.37 v48.9,17.02 | TX.2 5.33,14.73 2.79,12.83 2.79,8.38 3.56,8.13
  Bottom 0.61: TX.2 7.54,18.47 V8ZA2P-2.P$2
LIPO_FB4
  Top 0.4: R42.2 72.4,98.8 72.4,88.8 75.2,86 76,86 77.2,87.2 77.2,93.6 78,94.4 79.2,94.4 80,95.2 80,96.4 84,100.4 103.95,100.4 LIPO_FB.4
MOSFET_CTRL1
  Top 0.61: 10A.1 18.84,66.29 42.8,66.29 45.72,63.37 CSD8503KCS.3
MOSFET_CTRL2
  Top 1.422: PTCFUSE1.1 48.54,40.96 45.75,42.04 45.75,42.2 45.64,42.31 45.64,54 37.2,58.5 CSD8503KCS1.3
N$1
  Top 0.4: 68.8,104.8 68,104.8 R39.1 | 68.8,104.8 70.4,104.8 R14.2 | 68.8,104.8 68.8,107.2 C130.1
N$2  (via drill 0.8)
  Top 0.4: 19.2,28.8 C21.1 18.8,28.4 | 27.2,30.8 C12.+ 27.6,31.2 | 22,36.8 F2.1 | 15.6,12.8 C1.1
  Top 0.61: CON1.3 8.19,8.7 9.02,9.53 9.02,12.42 | CON2.3 14.54,8.7 15.49,9.65 | 15.49,9.65 15.62,9.78 15.62,12.57 C1.1 | C2.1 22.1,10.89 v23.24,10.41 23.37,9.4 24.07,8.7 CON4.3 | 28.45,10.03 28.45,12.56 C18.1 | C19.1 34.56,12.04 34.56,12.03 35.05,11.54 35.05,10.03 36.38,8.7 CON6.3 38.67,8.7 v37.08,10.29 | 42.04,10.03 42.04,12.43 C20.1 | CON7.3 46,8.73 45.97,8.76 43.31,8.76 42.04,10.03 | v24.38,18.29 24.38,26.77 22.35,28.8 | 9.02,12.42 11.38,12.42 12.6,13.64 | 9.02,12.42 C17.1 | 28.45,10.03 29.72,10.03 v30.1,10.41 | v30.73,22.86 30.73,29.17 32.77,31.2 | v33.78,22.99 33.78,29.17 35.05,31.2 | CON3.3 16.45,8.7 15.49,9.65 | CON5.3 29.78,8.7 28.45,10.03 | 42.04,10.03 42.93,10.03 v43.56,10.67 | v36.58,27.18 36.58,30.57 37.21,31.2
  Top 1.27: 25.2,28.8 22.35,28.8
  Top 1.422: 22.35,28.8 22,28.8 | 22,28.8 19.2,28.8 | 27.2,30.8 25.2,28.8 | 27.6,31.2 32.77,31.2 35.05,31.2 37.21,31.2 38.4,31.2 C13.+ | 22,28.8 22,36.8 | 18.8,28.4 12.6,23.35 12.6,13.64 15.6,12.8
  Bottom 0.61: v24.38,18.29 24.38,11.3 v23.24,10.41 | v30.1,10.41 30.1,22.23 v30.73,22.86 | v37.08,10.29 33.78,12.57 v33.78,22.99 | v43.56,10.67 43.56,12.32 37.47,18.41 37.47,26.29 v36.58,27.18
N$3
  Top 0.61: C8.+ 25.88,87.66 IC5.1 21.61,96.81 D2.C
N$4  (via drill 0.8)
  Top 0.406: IC7.22 62.51,40.03 v60.58,39.62 | v64.01,38.1 65.83,38.1 R48.2
  Bottom 0.406: v64.01,38.1 62.23,38.1 v60.58,39.62
N$5
  Top 0.406: IC7.23 63.16,41.49 63.75,40.89 63.75,39.88 62.36,38.48 R47.2
N$6
  Top 0.406: LED24.C 62.36,34.13 R47.1
N$7  (via drill 0.8)
  Top 0.406: C30.1 76.71,16 L1.1 | 76.07,15.88 C30.1 | v71.5,14.35 73.97,11.89 74.19,11.89 TIVA1.VBUS | v73.91,17.14 75.18,15.88 C30.1
  Bottom 0.406: v71.5,14.35 71.5,14.99 v73.91,17.14
N$8
  Top 0.406: R48.1 65.91,34.39 LED25.C
N$9
  Bottom 1.422: 20A.2 5.6,70.61 MAIN_PWR_SW.1
N$10  (via drill 0.8)
  Top 0.406: L1.2 76.71,22.1 C25.1 76.96,26.49 C23.+ 76.2,27.61 v76.2,29.72 | IC4.20 75.04,40.79 v76.33,39.5
  Bottom 0.406: v76.2,29.72 76.71,30.23 76.71,39.12 v76.33,39.5
N$11
  Top 0.406: IC4.15 71.79,40.48 73.66,37.72 73.66,20.07 72.01,18.54 68.83,15.62 68.83,4.7 69.98,3.56 74.93,3.56 75.82,4.45 75.82,11.35 TIVA1.D+
N$12
  Top 0.406: TIVA1.D- 75.04,13.6 73.66,15.24 72.52,15.24 71.78,16.61 72.26,17.14 74.55,19.43 74.55,38.1 72.44,41.36 IC4.16
N$13
  Top 0.406: LED3.C 80.9,34.52 R37.1
N$14
  Bottom 0.61: LIPO_INPUT.P$2 3.61,99.38 20A.1
N$15
  Top 0.406: LED4.C R38.1
N$16
  Top 0.406: IC4.23 76.96,42.44 76.96,41.4 78.11,41.02 79.84,41.02 80.9,39.97 R37.2
N$17
  Top 0.406: IC4.22 76.34,41.14 77.72,39.88 78.23,39.37 R38.2
N$18  (via drill 0.8)
  Top 0.4: LED2.5 89.6,83.6 90.4,83.6 92,85.2 92,86 92.4,86.4 96.4,86.4 105.6,77.2 RGBLED.4
  Top 0.406: R24.1 51.56,103.5 v52.32,102.62 | v60.58,92.71 60.58,89.03 68.71,80.9 72.9,80.9 73.79,81.79 v76.71,81.79 | v87.63,83.95 88.42,83.31 LED2.5
  Bottom 0.406: v52.32,102.62 52.32,99.69 54.61,97.41 54.61,95.76 57.91,92.71 v60.58,92.71 | v76.71,81.79 85.22,81.79 v87.63,83.95
N$19
  Top 0.4: R27.2 63.2,99.2 66,99.2 R43.1
N$20  (via drill 0.8)
  Top 0.4: v50.4,74 48.8,75.6 Q2.3 | v52.8,71.6 64.8,71.6 v65.6,72.4 | v78.4,57.6 78.4,56.8 v76.8,55.2 | v84,51.6 v81.35,54.25 | v89.6,66 89.6,69.6 93.2,73.2 BUZZER.-
  Bottom 0.4: v52.8,71.6 v50.4,74 | v65.6,72.4 69.2,68.8 69.2,60.4 72,57.6 v78.4,57.6 | v76.8,55.2 80.4,55.2 v81.35,54.25 | v84,51.6 90,57.6 90,65.6 v89.6,66
N$21
  Top 0.4: Q2.1 46,76.8 43.2,76.8 R28.1
N$22
  Top 0.4: DTC114EET1G1-4.1 88.8,93.6 88,94.4 86,94.4 84.8,93.2 R1.2
N$24
  Top 0.4: R17.2 96.8,92.4 97.6,92.4 98.4,91.6 101.6,91.6 102.8,92.8 LED19.C
N$25  (via drill 0.8)
  Top 0.4: v91.2,94 91.2,92.8 DTC114EET1G1-4.3 | v93.6,94.8 93.6,93.6 94.4,92.8 R17.1
  Bottom 0.4: v91.2,94 82.4,94 82,94.4 80.8,94.4 80,95.2 80,96.4 80.8,97.2 81.6,97.2 82.4,96.4 92,96.4 v93.6,94.8
N$26
  Top 0.4: DTC114EET1G1-5.1 89.6,90.4 86.8,90.4 R3.2
N$27  (via drill 0.8)
  Top 0.4: v57.01,102.8 54.03,106.93 R25.2 | v88.4,86.8 88.4,86.4 88,86 | 89.45,81.62 LED2.6 89.6,81.6 90.8,80.4 101.2,80.4 105.6,76 RGBLED.3
  Top 0.406: 88,86 87.98,85.98 86.87,85.98 86.23,85.34 86.23,83.95 87.8,82.38 88.65,81.62 89.45,81.62
  Bottom 0.4: v57.01,102.8 67.2,102.8 78,92 79.2,92 80,91.2 80,87.6 80.8,86.8 v88.4,86.8
N$28  (via drill 0.8)
  Top 0.4: v55.6,100 49.2,100 R30.2 | v68,92 74.8,85.2 76.4,85.2 78,86.8 82,86.8 83.86,84.94 83.86,83.74 92.4,75.2 v103.6,75.2 | v91.2,86.8 89.6,85.2 LED2.4
  Bottom 0.4: v55.6,100 60,100 v68,92 | RGBLED.2 105.6,74.4 104.8,75.2 v103.6,75.2 103.6,82.4 99.2,86.8 v91.2,86.8
N$29
  Top 0.4: DTC114EET1G1-1.3 43.6,103.6 47.2,103.6 R24.2
N$30
  Top 0.4: DTC114EET1G1-2.3 43.2,107.2 47.2,107.2 R25.1
N$31
  Top 0.4: DTC114EET1G1-3.3 43.2,100 47.2,100 R30.1
N$32
  Top 0.4: R2.2 96.8,89.6 99.2,89.6 LED1.C
N$33
  Top 0.4: DTC114EET1G1-5.3 92,89.2 94.4,89.2 R2.1
N$34  (via drill 0.8)
  Top 0.406: C26.1 71.75,52.45 71.63,52.32 71.63,51.44 70.48,50.29 70.48,48.64 v71.88,47.62 | IC4.17 73.09,45.15 v73.03,45.21
  Bottom 0.406: v71.88,47.62 72.39,47.62 v73.03,45.21
N$35
  Top 0.406: IC4.2 79.59,47.84 78.74,46.61 72.14,46.61 70.36,44.32 70.36,41.02 72.77,37.34 72.77,28.32 RST_FTDI_TIVA1.2
N$36
  Top 0.4: DTC114EET1G1-6.1 78,98.4 76.4,98.4 76,98 75.2,98 R5.2
N$37
  Top 0.4: DTC114EET1G1-1.1 40.8,104.4 39.2,104.4 38,103.2 R31.2
N$38
  Top 0.4: DTC114EET1G1-2.1 40.8,107.6 38,107.6 37.6,107.2 R32.2
N$39
  Top 0.4: DTC114EET1G1-3.1 40.8,100.4 38,100.4 37.6,100 R33.2
N$40
  Top 0.4: LED5.C 86.8,102.4 84,102.4 R4.2
N$41
  Top 0.4: DTC114EET1G1-6.3 79.2,100.8 80,100.8 82,102.8 R4.1
N$42
  Top 0.4: DTC114EET1G1-7.1 89.2,97.2 88,97.2 86.8,96 R7.2
N$43
  Top 0.4: R6.2 96.4,96.8 99.2,96.8 LED6.C
N$44
  Top 0.4: DTC114EET1G1-7.3 91.6,96.8 94.4,96.8 R6.1
N$53  (via drill 0.8)
  Top 0.406: R15.1 97.41,19.09 97.41,16.76 v95.5,14.86 | LED8.A 99.06,28.83 98.81,29.08 92.58,29.08 89.15,32.51 v89.15,36.58 | v83.82,37.08 83.57,36.83 v83.57,16.38
  Bottom 0.406: v89.15,36.58 88.65,37.08 v83.82,37.08 | v83.57,16.38 85.09,14.86 v95.5,14.86
N$54  (via drill 0.8)
  Top 0.406: LED9.A 94.21,27.21 v94.11,27.3 | v92.84,17.02 92.84,9.91 v94.23,8.51 | v97.92,6.99 99.61,6.99 R16.1
  Bottom 0.406: v94.23,8.51 96.39,8.51 v97.92,6.99 | v94.11,27.3 89.15,27.3 85.98,24.13 85.98,21.21 87.12,20.07 89.79,20.07 v92.84,17.02
N$55
  Top 0.4: R15.2 98,21.2 98,23.6 XB1.15
N$56
  Top 0.4: R16.2 98,4.58 98,2 XB1.6
N$70
  Top 1.422: PTCFUSE1.2 45.51,36.07 F2.2
N$73
  Top 0.406: R45.2 LED12.A
N$74
  Top 0.406: R46.2 51.05,17.11 LED13.A
N$76
  Top 0.61: R35.2 6.51,48.67 4.95,47.12 4.95,43.1 U$4.P4
N$92
  Top 0.406: ACTUATOR1.VBUS 61.21,11.68 59.56,13.34 59.56,14.22 59.82,14.48 60.83,14.48 C74.1 | 61.98,15.24 C74.1 | C74.1 61.85,15.36 L2.1
N$93
  Top 0.406: L2.2 61.85,22.1 C24.1 61.65,22.81 C22.+ 61.65,26.98 62.41,26.98 64.39,28.96 66.42,28.96 67.31,29.84 67.31,32.26 68.07,33.02 68.07,39.5 67.18,40.39 67.18,44.07 66.67,44.96 61.59,44.96 61.21,44.07 61.21,43.12 IC7.20
N$94  (via drill 0.8)
  Top 0.406: IC7.15 57.96,40.59 58.55,38.86 58.55,13.97 57.81,13.48 | 57.81,13.48 v57.58,13.32 57.66,13.32 57.81,13.48 | v63.88,13.72 62.81,13.41 ACTUATOR1.D+
  Bottom 0.406: v63.88,13.72 65.91,13.72 67.31,16.26 67.31,17.02 66.67,18.54 59.94,18.54 58.55,17.65 58.55,14.8 v57.58,13.32
N$95  (via drill 0.8)
  Top 0.406: IC7.16 58.61,41.09 59.69,39.5 v59.69,15.88 | ACTUATOR1.D- 61.98,11.79 61.98,12.57 v61.59,13.59
  Bottom 0.406: v61.59,13.59 60.58,13.59 v59.69,15.88
N$115
  Top 0.406: C27.1 58.92,52.45 56.77,50.04 56.77,48.01 59.18,45.47 59.26,45.39 IC7.17
N$116
  Top 0.406: IC7.2 65.76,50.77 66.29,50.93 67.82,50.93 68.2,50.55 68.2,41.27 71.37,37.21 RST_ACTUATOR1.2
N$337
  Top 0.4: R42.1 70.4,99.2 68,99.2 R43.2
N$338
  Top 0.4: 102.36,104.8 80,104.8 77.2,102 72.4,102 R40.2
  Top 0.406: LIPO_FB.3 104.93,102.23 102.36,104.8
N$378
  Top 0.61: FITPC.P$1 13.21,102.23 C16.1 13.21,95.95 C36.1 13.6,92.89 C37.1 13.5,88.71 C35.+ 14.45,86.92 10A.2
N$381
  Top 0.4: POWERLED4.A 8.4,66 8.38,65.91
  Top 0.61: R36.1 8.38,65.91
P2  (via drill 0.8)
  Top 0.4: v63.2,1.64 54.55,1.64 54,1.6 47.6,1.6 v46.8,2.4 | v46,12.15 46,17.2 50.8,22 55.2,22 55.6,22.4 55.6,27.94 52.4,31.14 52.4,42.8 55.6,46 55.6,55.6 v63.2,63.2 | v66,63.2 70.4,63.2 v72.4,65.2
  Top 0.406: v98.04,32.64 101.63,32.64 v102.4,32
  Bottom 0.4: v102.4,32 106.4,28 FORCE_LEFT.1 | v46.8,2.4 46.8,4 47.2,4.4 47.2,11.2 v46,12.15 | v66,63.2 v63.2,63.2 | v72.4,65.2 75.6,65.2 82.8,72.4 82.8,74 81.6,75.2 U$1.P$2
  Bottom 0.406: v63.2,1.64 63.96,2.37 90.81,30.86 92.58,32.64 v98.04,32.64
P3  (via drill 0.8)
  Top 0.406: IC4.1 80.26,50 v80.26,51.56
  Bottom 0.406: v80.26,51.56 84.58,55.37 84.58,76.58 83.19,77.98 U$1.P$3
P4
  Top 0.406: IC4.5 77.6,49.76 77.6,54.36 83.69,60.45 83.69,79.63 82.8,80.52 U$1.P$4
P5  (via drill 0.8)
  Top 0.4: 59.2,98.8 61.2,98.8 R27.1 | 59.2,98.8 58.8,98.8 R44.2 59.2,98.8 | 59.2,98.8 59.2,96.4 C14.1 59.2,96 v70.8,84.4
  Bottom 0.406: v70.8,84.4 79.94,84.4 U$1.P$5
P6  (via drill 0.8)
  Top 0.4: 68,102 70.4,102 R40.1 70.4,101.6 71.6,100.4 73.2,100.4 73.6,100 73.6,95.2 75.6,93.2 v75.6,87.2 | 68,102 66.8,103.2 65.2,103.2 64,102 63.2,102 C15.1 | 68,102 R41.2
  Bottom 0.4: v75.6,87.2 76,86.8 79.2,86.8 80.4,85.6 81.2,85.6 U$1.P$6
P7  (via drill 0.8)
  Top 0.4: R14.1 72.8,104.8 78.8,104.8 79.6,105.6 105.6,105.6 LIPO_FB.2 106,104.82 107.58,103.75 107.58,99.73 106.67,97.8 v106.8,90.8
  Bottom 0.4: v106.8,90.8 104.4,88.4 81.6,88.4 U$1.P$7
P8
  Top 0.4: R3.1 84.8,90.8 81.6,90.8 U$1.P$8
  Bottom 0.4: LED.4 107.6,92 93.6,92 91.6,90 82,90 81.6,90.4 U$1.P$8
P9  (1 unrouted)
  Bottom 0.4: LED.3 107.6,93.6 95.2,93.6 94.4,92.8 82,92.8 81.6,93.2 U$1.P$9
P10
  Top 0.4: R7.1 84.8,96 81.6,96 U$1.P$10
  Bottom 0.4: LED.2 107.6,94.8 95.2,94.8 94,93.6 93.2,93.6 91.2,95.6 81.6,95.6 U$1.P$10
P13  (via drill 0.8)
  Top 0.4: v96,49.2 108.4,36.8 108.4,31.2 106.8,29.6 FORCE_LEFT.2 | v56,76.4 57.2,76.4 58.4,77.6 78.4,77.6 U$1.P$13
  Bottom 0.4: v96,49.2 78,49.2 75.2,52 72.8,52 58.8,66 58.8,73.6 v56,76.4
P14
  Bottom 0.4: FORCE_LEFT.3 106.8,31.2 108.4,32.8 108.4,50 85.6,72.8 85.6,76.8 83.2,79.2 80,79.2 78.8,80.4 U$1.P$14
P15  (via drill 0.8)
  Top 0.4: v104,39.6 v104,35.2
  Top 0.406: v85.6,71.2 85.6,80.52 82.04,84.33 80.01,84.33 U$1.P$15
  Bottom 0.4: v104,35.2 106.4,32.8 FORCE_LEFT.4 | v104,39.6 104,53.2 86,71.2 v85.6,71.2
P16  (via drill 0.8)
  Top 0.4: v49.2,66.4 61.6,66.4 v69.2,74
  Top 0.406: v73.41,83.19 76.33,83.19 U$1.P$16
  Bottom 0.4: v49.2,66.4 27.2,44.4 25.2,44.4 4.4,23.6 3.6,23.6 FORCE_RIGHT.1 | 69.2,79.05 v69.2,74
  Bottom 0.406: 69.2,79.05 73.34,83.19 v73.41,83.19
P17
  Bottom 0.4: FORCE_RIGHT.2 3.6,24.8 24,45.2 24,60 28.8,64.8 28.8,80.8 34.8,86.8 36,86.8 36.8,87.6 36.8,91.2 37.6,92 42.4,92 45.6,95.2 50.8,95.2 57.6,88.4 78.4,88.4 U$1.P$17
P18
  Bottom 0.4: FORCE_RIGHT.3 3.6,26.4 23.2,46 23.2,83.2 32,92 36,92 36.8,92.8 36.8,93.6 37.6,94.4 43.6,94.4 45.2,96 51.2,96 56.4,90.8 78.4,90.8 U$1.P$18
P19
  Bottom 0.4: FORCE_RIGHT.4 3.6,28 22.4,46.8 22.4,89.6 23.2,90.4 23.2,91.2 36.8,104.8 69.2,104.8 74.4,99.6 74.4,97.2 78.4,93.2 U$1.P$19
P20
  Top 0.4: R5.1 75.2,96 78.4,96 U$1.P$20
  Bottom 0.4: LED.1 107.6,96.4 93.2,96.4 92,97.6 82.4,97.6 82,98 80.4,98 78.4,96 U$1.P$20
P21
  Top 0.4: R21.2 37.6,69.6 37.6,72.4 38,72.8 U$1.P$21
  Bottom 0.4: CSD8503KCS.1 53.6,63.6 52.8,64.4 52.8,64.8 44.8,72.8 38.4,72.8 U$1.P$21
P22
  Bottom 0.4: U$1.P$22 38,75.2 36.8,74 36.8,71.6 43.6,64.8 43.6,62 31.6,50 30.4,50 PIN22.1
P23
  Top 0.4: R28.2 41.2,76.8 39.2,76.8 38.4,77.6 U$1.P$23
P24  (via drill 0.8)
  Top 0.4: v49.6,78 48.8,78.8 48,78.8 Q1.2 | R23.1 41.2,80.4 38.4,80.4 U$1.P$24
  Bottom 0.4: v49.6,78 40.8,78 38.4,80.4 U$1.P$24
P25
  Top 0.4: Q5.3 46.8,86 42,86 41.2,85.2 R26.1 41.2,84.8 39.6,83.2 38.4,83.2 U$1.P$25
P28  (via drill 0.8)
  Top 0.4: C6.1 47.6,90.8 46.4,90.8 44.8,89.2 43.6,89.2 42.4,90.4 R11.1 42.4,90.8 38.4,90.8 U$1.P$28 38,90.4 36.8,89.2 36.8,87.6 36,86.8 v33.2,86.8 | v91.18,36.02 92,37.6 92,51.2 106.4,65.6 106.8,65.6 SW1.3 | v43.2,29.2 43.2,32.62 28,48.97 28,64 v27.2,64.8
  Bottom 0.4: v91.18,36.02 64.8,10.78 64.4,10.4 62.4,8.4 62.4,7.6 57.6,2.8 54.8,2.8 53.2,4.4 53.2,8 43.2,18 v43.2,29.2 | v27.2,64.8 27.2,80.8 v33.2,86.8
P29  (via drill 0.8)
  Top 0.4: R10.1 42.4,93.6 38.4,93.6 U$1.P$29 38,93.6 36.8,94.8 36.8,96.4 37.2,96.8 v37.2,97.33 | v54,94.8 54,91.6 51.6,89.2 49.6,89.2 49.2,89.6 49.2,92 48,93.2 C4.1 | v84,98.8 102.8,98.8 105.2,96.4 105.2,90.8 108,88 108,68.4 107.2,67.6 SW1.2 | v69.2,103.2 v74.8,103.2
  Bottom 0.4: 50.84,97.33 v54,94.8 | v37.2,97.33 50.84,97.33 | v84,98.8 79.6,103.2 v74.8,103.2 | v69.2,103.2 68,103.2 67.2,104 52.8,104 50.84,103.44 50.84,97.33
P30  (via drill 0.8)
  Top 0.4: 42.4,96 38.4,96 U$1.P$30 | 42.4,96 43.6,97.2 45.2,97.2 46.4,96 47.6,96 C5.1 47.6,95.6 v46,94 | 42.4,96 R9.1 | v88.8,58 90.4,58 101.2,68.8 106.8,68.8 SW1.1 | v73.6,53.2 72.8,54 64.4,54 64.4,67.6 v69.2,72.4
  Bottom 0.4: v88.8,58 80.8,50 78.4,50 75.2,53.2 v73.6,53.2 | v69.2,72.4 47.6,94 v46,94
P33
  Top 0.4: R13.2 32,77.6 35.2,77.6 U$1.P$33
  Bottom 0.4: CSD8503KCS1.1 42,63.6 42,64.8 34,72.8 34,76.4 35.2,77.6 U$1.P$33
P34  (via drill 0.8)
  Top 0.4: C7.1 28,72.8 31.2,72.8 R12.1 31.6,72.8 32.4,72.8 v33.2,72 | v41.37,36.18 41.37,39.33 35.47,42.93 v35.6,64.8
  Top 0.406: v92.17,34.62 93.44,35.76 93.44,50.65 93.69,51.03 105.4,62.74 105.4,62.89 SW1.4
  Bottom 0.4: v92.17,34.62 61.2,2 54.4,2 52.4,4 52.4,7.6 41.24,18.76 v41.37,36.18 | v35.6,64.8 35.6,70 33.2,72.4 | 33.2,72.4 33.2,78.4 35.2,80.4 U$1.P$34 | 33.2,72.4 v33.2,72
P35  (via drill 0.8)
  Top 0.406: RST_FTDI_TIVA1.1 RST_ACTUATOR1.1 69.47,31.24 v69.47,37.85
  Bottom 0.406: v69.47,37.85 69.47,52.7 67.82,54.36 62.23,54.36 57.78,58.8 57.78,72.9 49.02,81.79 35.94,81.79 35.56,82.17 U$1.P$35
P38  (via drill 0.8)
  Top 0.4: v32.4,90.8 32.4,98.4 35.6,101.6 35.6,102.8 R31.1
  Bottom 0.4: v32.4,90.8 35.2,90.8 U$1.P$38
P39  (via drill 0.8)
  Top 0.4: v24.4,90.8 20.4,94.8 20.4,99.2 20.8,99.6 22,99.6 29.2,106.8 35.6,106.8 R32.1
  Bottom 0.4: v24.4,90.8 29.6,90.8 32,93.2 35.2,93.2 U$1.P$39
P40
  Top 0.4: R33.1 35.6,99.6 35.6,96 U$1.P$40
RX3  (via drill 0.8)
  Top 0.406: v82.68,55.24 82.68,54.48 85.47,51.69 85.47,6.69 XB1.2
  Bottom 0.406: U$1.P$26 38.61,85.6 41.15,83.06 50.8,83.06 56.64,77.22 59.18,77.22 67.18,69.22 67.18,59.05 69.72,56.52 81.41,56.52 v82.68,55.24
TIVA_RX  (via drill 0.8)
  Top 0.4: Q1.3 47.2,81.2 49.2,81.2 50.4,80 R22.1 50.8,79.6 v50.8,76.8 | v21.2,7.6 21.2,5.2 19.47,1.7 5.87,1.7 2.8,6.8 2.8,16 TX.1
  Bottom 0.4: v50.8,76.8 50.8,75.2 55.2,70.8 55.2,56 44.4,45.2 44.4,41.2 21.2,18 v21.2,7.6
TIVA_TX  (via drill 0.8)
  Top 0.4: 48.4,84 49.6,84 50.4,84.8 R29.1 | 48.4,84 48,84 Q5.2 | v48.4,85.6 48.4,84 | v30,80.4 21.2,80.4 8.4,67.6 7.2,67.6 2,62.4 2,20.4 2.8,19.6 RX.1
  Bottom 0.4: v48.4,85.6 40,85.6 38.8,86.8 37.6,86.8 36.8,86 36.8,84.8 36.4,84.4 34,84.4 v30,80.4
TX3  (via drill 0.8)
  Top 0.406: v83.44,56.77 85.6,56.77 87.38,51.69 87.38,27.81 92.46,26.04 106.55,26.04 108.46,24.13 108.46,22.53 91.82,3.87 91.82,1.92 XB1.3
  Bottom 0.406: U$1.P$27 51.94,88.14 70.23,69.85 70.23,60.58 71.63,59.18 81.28,59.18 v83.44,56.77
VCC  (via drill 0.8)
  Top 0.4: CSD8503KCS1.2 40,63.2 40.8,62.4 40.8,62 41.6,61.2 49.2,61.2 51.2,63.2 CSD8503KCS.2 | 17.6,54.8 C9.+
  Top 0.406: 16.72,51.9 17.4,52.58
  Top 0.61: R36.2 6.67,52.25 | 17.4,54.74 17.43,54.77 | 17.53,54.86 17.43,54.77 | 17.43,54.77 C9.+ | 1N4742.C 17.4,46.13
  Top 1.422: 6.67,52.25 7.87,51.05 10.92,51.05 C3.1 16.72,51.9 | 17.4,46.13 17.4,52.58 17.4,54.74 | v25.2,59.6 22.4,59.6 17.6,54.8 | U$4.P2 6.79,57.21 5.71,56.39 5.71,54.46 R36.2
  Bottom 0.4: 39.6,63.2 CSD8503KCS1.2
  Bottom 0.61: 7.11,57.95 U$4.P2
  Bottom 1.422: MAIN_PWR_SW.2 4.84,65.01 7.11,62.74 7.11,57.95 | 39.6,63.2 39.69,62.15 39.69,60.48 36.4,59.6 v25.2,59.6